# EasyEDA schematic SCH_praktikum-gib-mir-mal-ne-wago.json
TITLE: Sheet_1; REV: 1.0; Date: 2024-04-24; Sheet: 1/1; Drawn By: AndreBell; Company: Your Company
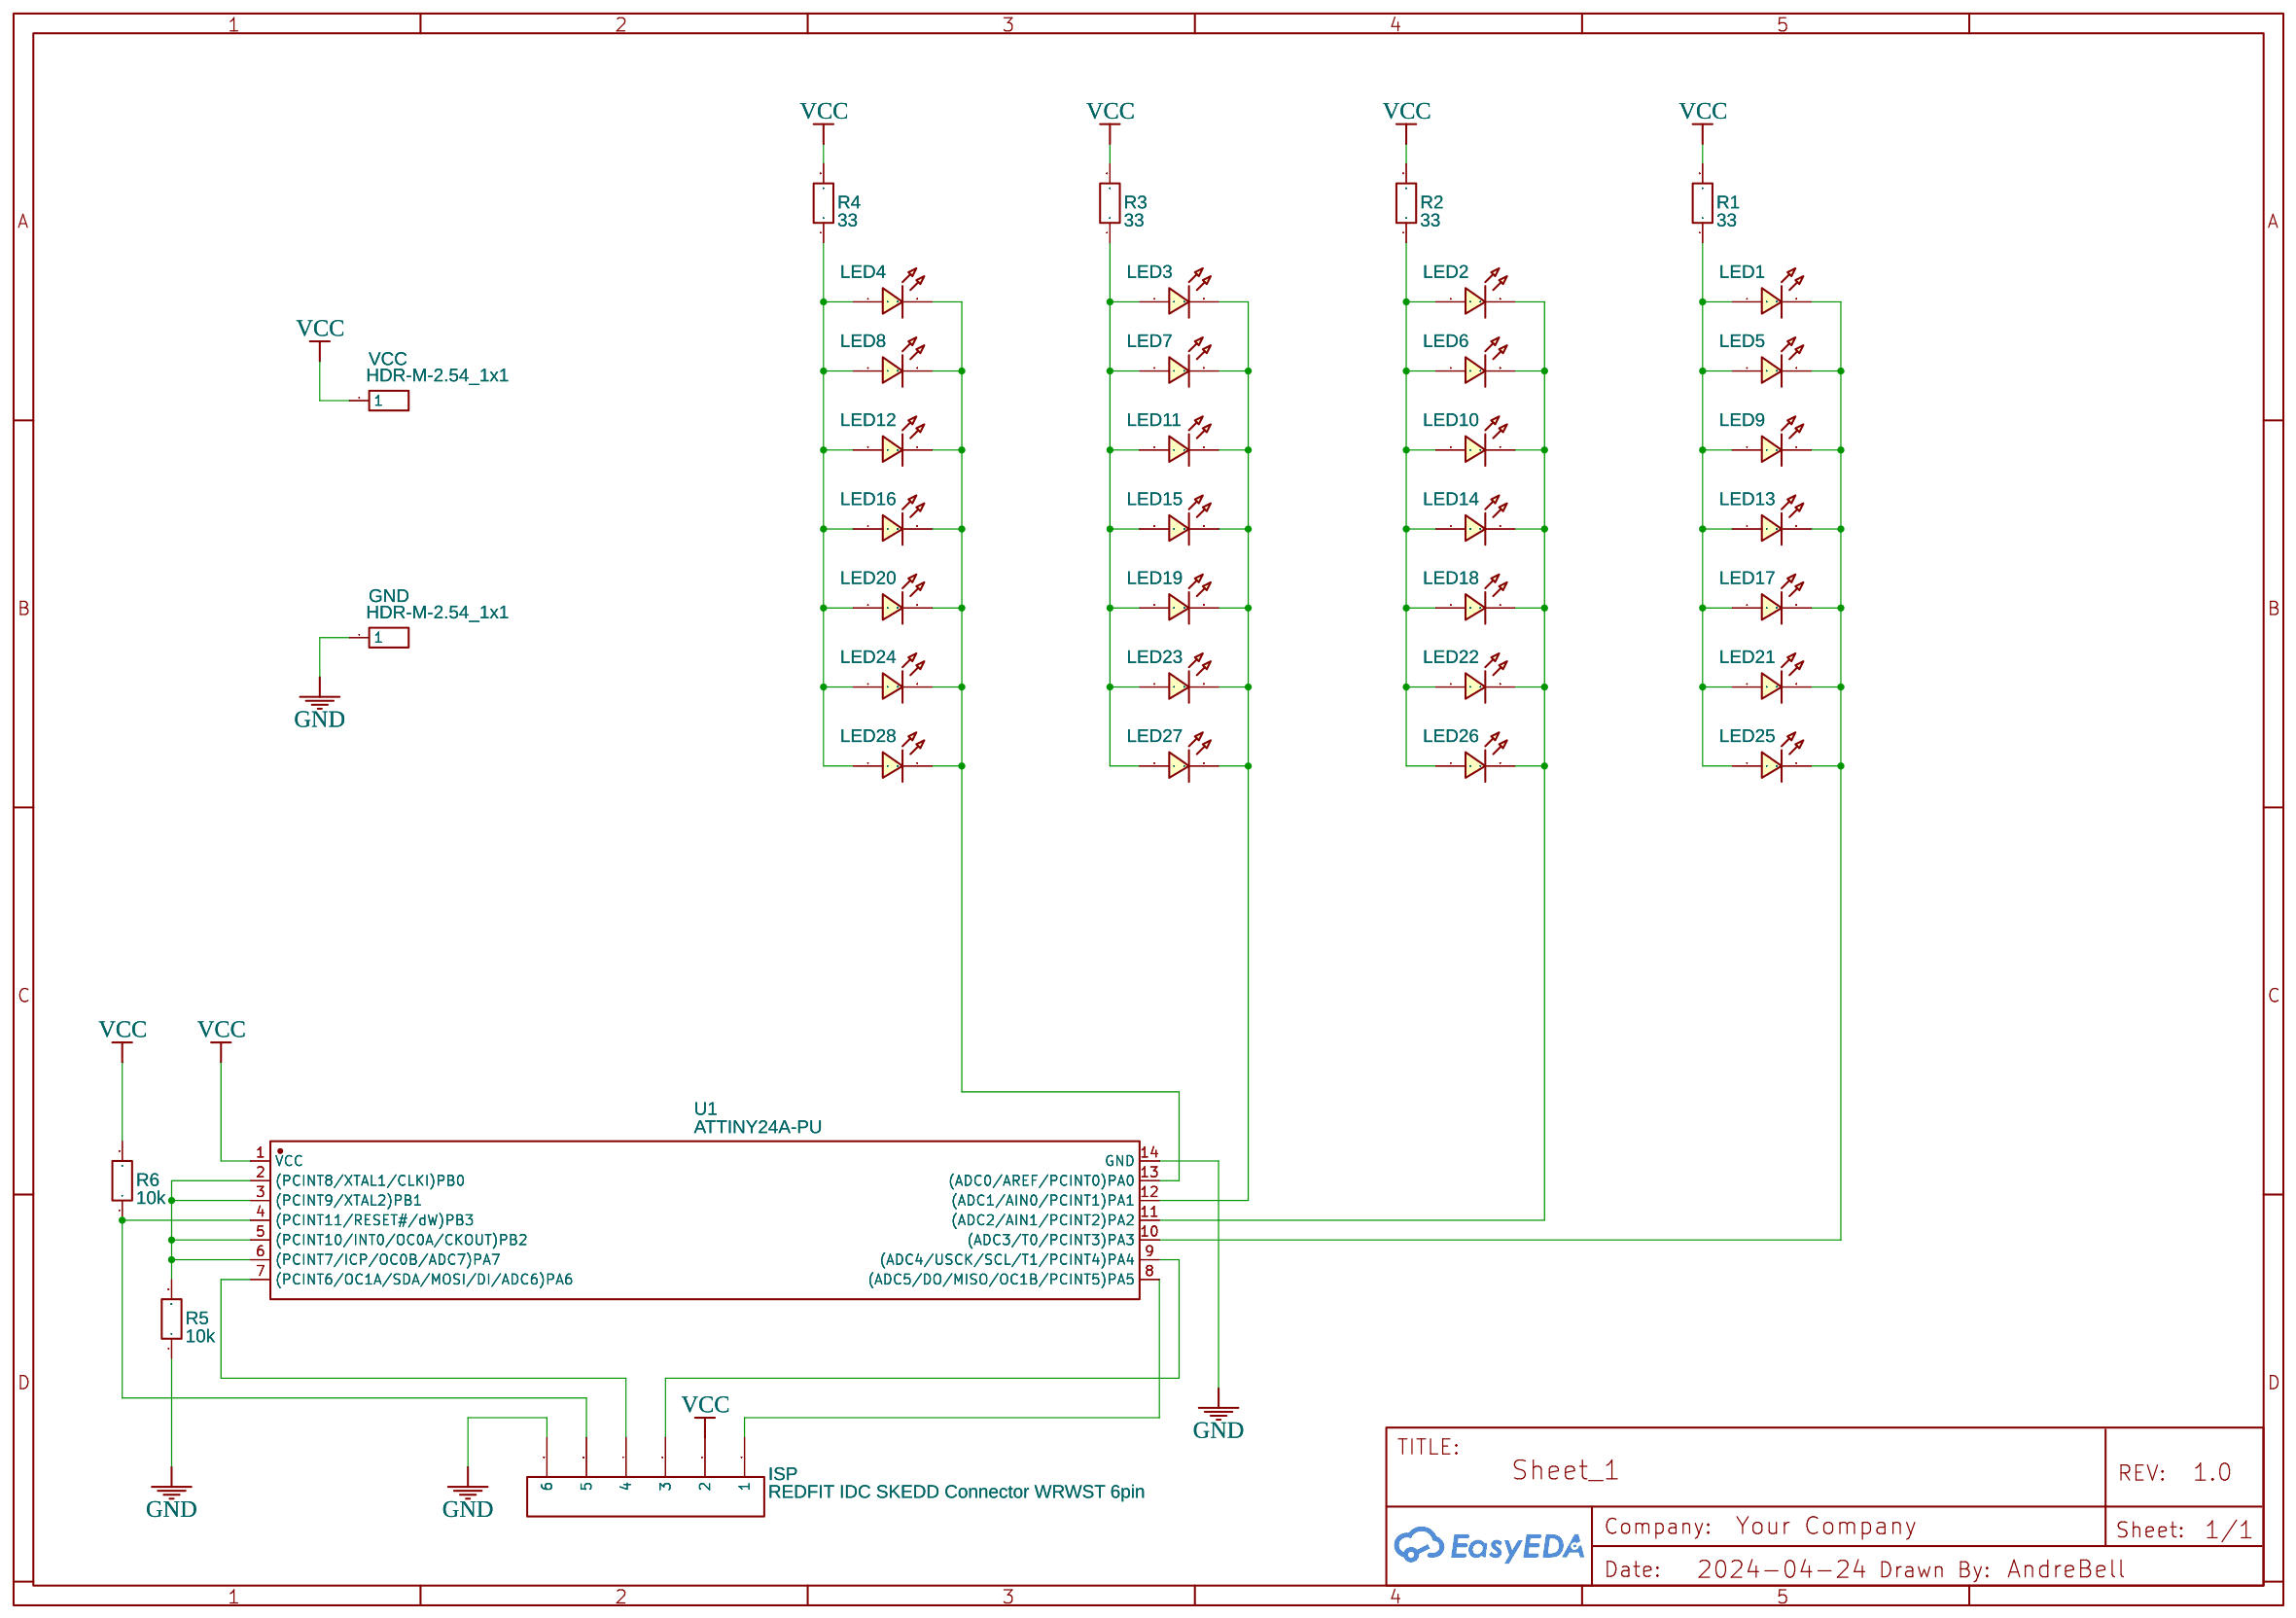
[diagram p0: schematic sheet]

## Parts
GND  HDR-M-2.54_1x1  [HDR-M-2.54_1X1]
ISP  REDFIT IDC SKEDD Connector WRWST 6pin  [REDFIT IDC SKEDD CONNECTOR WRWST 6PIN]
LED1  LED-TH-3mm_G  [LED-TH_BD3.0_GREEN]
LED2  LED-TH-3mm_G  [LED-TH_BD3.0_GREEN]
LED3  LED-TH-3mm_G  [LED-TH_BD3.0_GREEN]
LED4  LED-TH-3mm_G  [LED-TH_BD3.0_GREEN]
LED5  LED-TH-3mm_G  [LED-TH_BD3.0_GREEN]
LED6  LED-TH-3mm_G  [LED-TH_BD3.0_GREEN]
LED7  LED-TH-3mm_G  [LED-TH_BD3.0_GREEN]
LED8  LED-TH-3mm_G  [LED-TH_BD3.0_GREEN]
LED9  LED-TH-3mm_G  [LED-TH_BD3.0_GREEN]
LED10  LED-TH-3mm_G  [LED-TH_BD3.0_GREEN]
LED11  LED-TH-3mm_G  [LED-TH_BD3.0_GREEN]
LED12  LED-TH-3mm_G  [LED-TH_BD3.0_GREEN]
LED13  LED-TH-3mm_G  [LED-TH_BD3.0_GREEN]
LED14  LED-TH-3mm_G  [LED-TH_BD3.0_GREEN]
LED15  LED-TH-3mm_G  [LED-TH_BD3.0_GREEN]
LED16  LED-TH-3mm_G  [LED-TH_BD3.0_GREEN]
LED17  LED-TH-3mm_G  [LED-TH_BD3.0_GREEN]
LED18  LED-TH-3mm_G  [LED-TH_BD3.0_GREEN]
LED19  LED-TH-3mm_G  [LED-TH_BD3.0_GREEN]
LED20  LED-TH-3mm_G  [LED-TH_BD3.0_GREEN]
LED21  LED-TH-3mm_G  [LED-TH_BD3.0_GREEN]
LED22  LED-TH-3mm_G  [LED-TH_BD3.0_GREEN]
LED23  LED-TH-3mm_G  [LED-TH_BD3.0_GREEN]
LED24  LED-TH-3mm_G  [LED-TH_BD3.0_GREEN]
LED25  LED-TH-3mm_G  [LED-TH_BD3.0_GREEN]
LED26  LED-TH-3mm_G  [LED-TH_BD3.0_GREEN]
LED27  LED-TH-3mm_G  [LED-TH_BD3.0_GREEN]
LED28  LED-TH-3mm_G  [LED-TH_BD3.0_GREEN]
R1  33  [R_AXIAL-0.4]
R2  33  [R_AXIAL-0.4]
R3  33  [R_AXIAL-0.4]
R4  33  [R_AXIAL-0.4]
R5  10k  [R_AXIAL-0.4]
R6  10k  [R_AXIAL-0.4]
U1  ATTINY24A-PU  [PDIP-14_L19.2-W6.4-P2.54-LS8.0-BL]
VCC  HDR-M-2.54_1x1  [HDR-M-2.54_1X1]

## Library data of the parts
GND VCC = HDR-M-2.54_1x1: Supplier Part: C81276; Supplier: LCSC; Contributor: LCEDA_Lib
ISP = REDFIT IDC SKEDD Connector WRWST 6pin: Contributor: AndreBell
LED1-LED28 = LED-TH-3mm_G: Manufacturer: EVERLIGHT(台湾亿光); Manufacturer Part: 204-10SYGD/S530-E3; Supplier Part: C85161; Contributor: LCEDA_Lib
R1-R6 = R_AXIAL-0.3_EU: Contributor: LCEDA_Lib; Package Display: No
U1 = ATTINY24A-PU: Contributor: LCSC; Supplier: LCSC; Supplier Part: C1339745; Manufacturer: MICROCHIP(美国微芯); JLCPCB Part Class: Extended Part

## Nets
GND: GND.1 ISP.6 R5.1 U1.14(GND)
VCC: ISP.2 R1.2 R2.2 R3.2 R4.2 R6.2 U1.1(VCC) VCC.1
Net-(ISP-1): ISP.1 U1.8((ADC5/DO/MISO/OC1B/PCINT5)PA5)
Net-(ISP-3): ISP.3 U1.9((ADC4/USCK/SCL/T1/PCINT4)PA4)
Net-(ISP-4): ISP.4 U1.7((PCINT6/OC1A/SDA/MOSI/DI/ADC6)PA6)
Net-(ISP-5): ISP.5 R6.1 U1.4((PCINT11/RESET#/dW)PB3)
Net-(LED1-1): LED1.1 LED5.1 LED9.1 LED13.1 LED17.1 LED21.1 LED25.1 R1.1
Net-(LED1-2): LED1.2 LED5.2 LED9.2 LED13.2 LED17.2 LED21.2 LED25.2 U1.10((ADC3/T0/PCINT3)PA3)
Net-(LED2-1): LED2.1 LED6.1 LED10.1 LED14.1 LED18.1 LED22.1 LED26.1 R2.1
Net-(LED2-2): LED2.2 LED6.2 LED10.2 LED14.2 LED18.2 LED22.2 LED26.2 U1.11((ADC2/AIN1/PCINT2)PA2)
Net-(LED3-1): LED3.1 LED7.1 LED11.1 LED15.1 LED19.1 LED23.1 LED27.1 R3.1
Net-(LED3-2): LED3.2 LED7.2 LED11.2 LED15.2 LED19.2 LED23.2 LED27.2 U1.12((ADC1/AIN0/PCINT1)PA1)
Net-(LED4-1): LED4.1 LED8.1 LED12.1 LED16.1 LED20.1 LED24.1 LED28.1 R4.1
Net-(LED4-2): LED4.2 LED8.2 LED12.2 LED16.2 LED20.2 LED24.2 LED28.2 U1.13((ADC0/AREF/PCINT0)PA0)
Net-(R5-2): R5.2 U1.2((PCINT8/XTAL1/CLKI)PB0) U1.3((PCINT9/XTAL2)PB1) U1.5((PCINT10/INT0/OC0A/CKOUT)PB2) U1.6((PCINT7/ICP/OC0B/ADC7)PA7)
